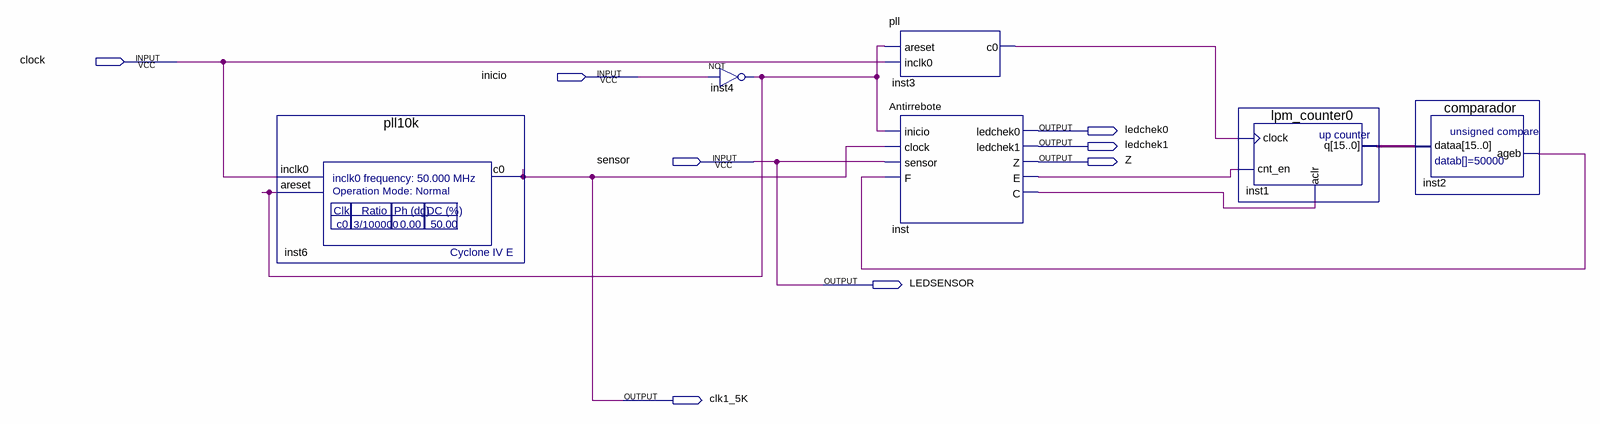
[diagram p0: schematic sheet]
// Quartus schematic Antirreboteesquema.bdf as structural Verilog: 6 symbols, 8 pins
module Antirreboteesquema (
  input  clock,
  input  inicio,
  input  sensor,
  output ledchek0,
  output ledchek1,
  output Z,
  output LEDSENSOR,
  output clk1_5K
);

  wire inst2_ageb, inst3_c0, inst4_out, inst_c, inst_e;
  wire [15:0] inst1_q;

  pll10k inst6 (.inclk0(clock), .areset(inst4_out), .c0(clk1_5K));
  not inst4 (inst4_out, inicio);
  pll inst3 (.areset(inst4_out), .inclk0(clock), .c0(inst3_c0));
  Antirrebote inst (
    .inicio(inst4_out), .clock(clk1_5K), .sensor(sensor), .F(inst2_ageb), .ledchek0(ledchek0),
    .ledchek1(ledchek1), .Z(Z), .E(inst_e), .C(inst_c));
  lpm_counter0 inst1 (.clock(inst3_c0), .cnt_en(inst_e), .aclr(inst_c), .q(inst1_q));
  comparador inst2 (.dataa(inst1_q), .ageb(inst2_ageb));

  assign LEDSENSOR = sensor;
endmodule
